# EAGLE design temperature (EAGLE 9.6.2)
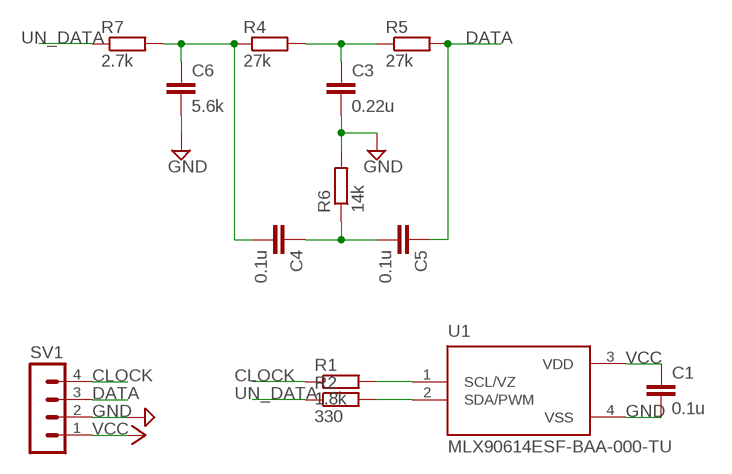
[diagram p0: schematic, sheet 1]

## Parts
C1  0.1u  C-EUC0603  [C0603]
C3  0.22u  C-EUC0603  [C0603]
C4  0.1u  C-EUC0603  [C0603]
C5  0.1u  C-EUC0603  [C0603]
C6  5.6k  C-EUC0603  [C0603]
R1  1.8k  R-EU_R0603  [R0603]
R2  330  R-EU_R0603  [R0603]
R4  27k  R-EU_R0603  [R0603]
R5  27k  R-EU_R0603  [R0603]
R6  14k  R-EU_R0603  [R0603]
R7  2.7k  R-EU_R0603  [R0603]
SV1  MA04-1  [MA04-1]
U1  MLX90614ESF-BAA-000-TU  [TO254P942H425-4]

## Nets
CLOCK: R1.1 SV1.4
DATA: C5.1 R5.2 SV1.3
GND: C1.2 C3.2 C6.2 R6.2 SV1.2 U1.4(VSS)
N$1: R1.2 U1.1(SCL/VZ)
N$2: R2.2 U1.2(SDA/PWM)
N$3: C3.1 R4.2 R5.1
N$4: C4.1 C5.2 R6.1
N$6: C4.2 C6.1 R4.1 R7.2
UN_DATA: R2.1 R7.1
VCC: C1.1 SV1.1 U1.3(VDD)

## Library data of the parts
C1 C3-C6 = rcl:C-EU: CAPACITOR, European symbol; SPICEPREFIX: C
R1 R2 R4-R7 = rcl:R-EU_: RESISTOR, European symbol; SPICEPREFIX: R
SV1 = con-lstb:MA04-1: PIN HEADER; OC_FARNELL: unknown; OC_NEWARK: unknown
U1 = MLX90614ESF-BAA-000-TU:MLX90614ESF-BAA-000-TU: Temperature Sensor Digital, Infrared (IR) -40°C ~ 85°C 16 b TO-39 Check prices <https://pricing.snapeda.com/parts/MLX90614ESF-BAA-000-TU/Melexis/view-part?ref=eda>; AVAILABILITY: In Stock; DESCRIPTION: Temperature Sensor Digital, Infrared (IR) -40°C ~ 85°C 16 b TO-39; MF: Melexis; MP: MLX90614ESF-BAA-000-TU; PACKAGE: TO-39 Melexis; PRICE: None; PURCHASE-URL: https://pricing.snapeda.com/search/part/MLX90614ESF-BAA-000-TU/?ref=eda

## Board
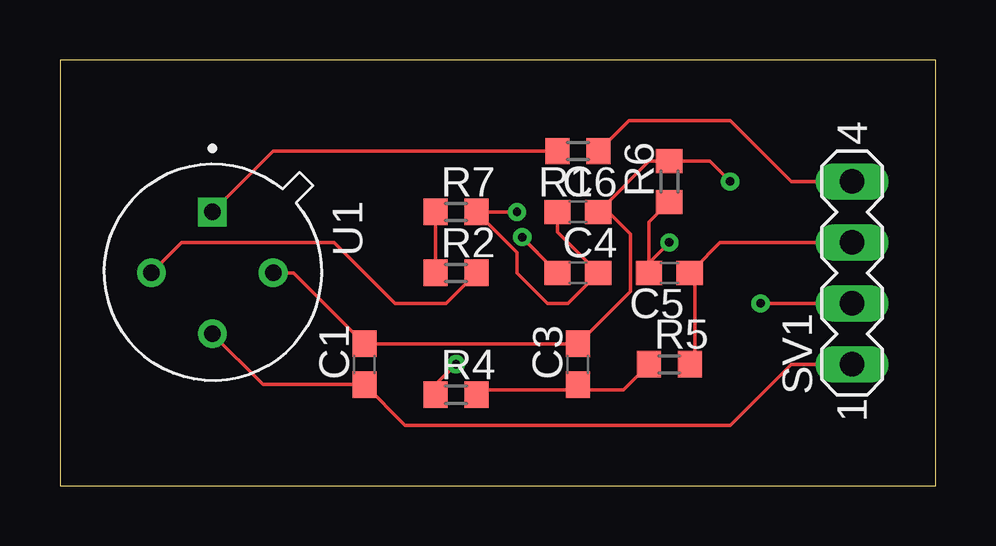
[diagram p1: board, top side]
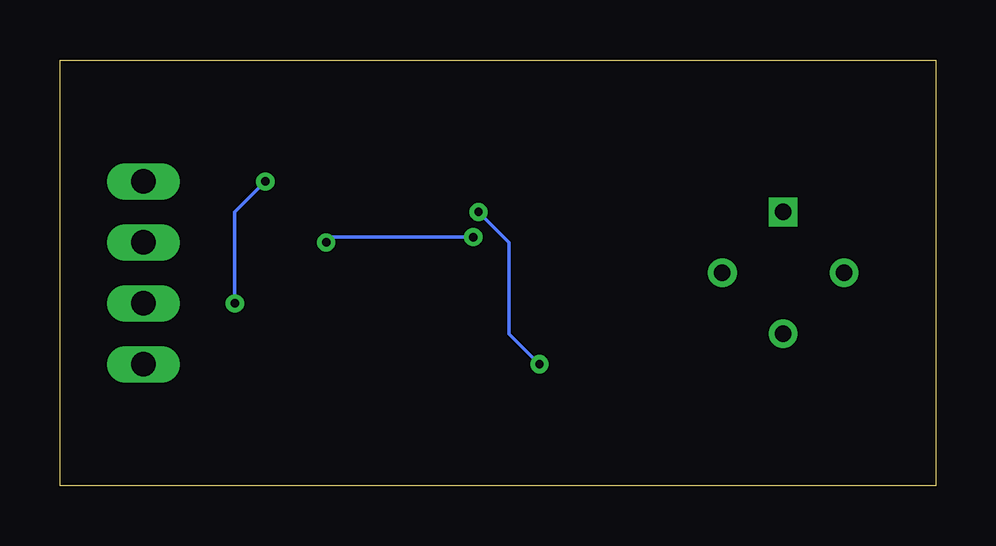
[diagram p2: board, bottom side, seen from below]

Size 36.5 x 17.77 mm. Coordinates in mm from the lower left corner, seen from the top.
Outline: 0,0 36.5,0 36.5,17.77 0,17.77 0,0
Copper layers (1*16): Top 0.035mm / dielectric 1.5mm / Bottom 0.035mm
Design rules "default": minimum track width 6mil, minimum drill 0.35mm, track to track 6mil, track to pad 6mil, pad to pad 6mil, via to via 6mil, smd to smd 6mil, copper to edge 40mil, drill to drill 6mil, minimum pad ring 10mil, minimum via ring 8mil, stop-mask expansion 4mil, vias tented up to drill 0mil, thermal gap 10mil

### Footprints (pad centres in the part's own frame; a part is rotated, then mirrored left to right if it is on the bottom)
C0603 = smd 1.1 x 1: 1 -0.85,0; 2 0.85,0
R0603 = smd 1 x 1.1: 1 -0.85,0; 2 0.85,0
MA04-1 = drill 1.016 long: 1 -3.81,0; 2 -1.27,0; 3 1.27,0; 4 3.81,0
TO254P942H425-4 = drill 0.69 pad 1.09 square: 1 -2.54,0 | drill 0.69 pad 1.09: 2 0,-2.54; 3 2.54,0; 4 0,2.54

### Placement (x,y rotation side)
C1  12.7,5.08 90 top
C3  21.59,5.08 90 top
C4  21.59,8.89 0 top
C5  25.4,8.89 180 top
C6  21.59,11.43 0 top
R1  21.59,13.97 180 top
R2  16.51,8.89 0 top
R4  16.51,3.81 0 top
R5  25.4,5.08 0 top
R6  25.4,12.7 90 top
R7  16.51,11.43 0 top
SV1  33.02,8.89 90 top
U1  6.35,8.89 270 top

### Tracks (layer width: path | path; a pad name or v marks a point on that pad's centre or on a via)
CLOCK
  Top 0.152: R1.1 23.71,15.24 27.94,15.24 30.48,12.7 SV1.4
DATA
  Top 0.152: C5.1 26.46,9.1 | 26.46,9.1 27.52,10.16 SV1.3 | R5.2 26.46,5.29 26.46,9.1
GND  (via drill 0.35)
  Top 0.152: U1.4 9.74,8.89 C1.2 C3.2 23.77,8.11 23.77,10.52 22.65,11.64 | 22.65,11.64 24.56,13.55 R6.2 27.09,13.55 v27.94,12.7 | 22.65,11.64 C6.2 | v29.21,7.62 SV1.2
  Bottom 0.152: v27.94,12.7 29.21,11.43 v29.21,7.62
N$1
  Top 0.152: U1.1 8.89,13.97 R1.2
N$2
  Top 0.152: U1.2 5.08,10.16 11.43,10.16 13.97,7.62 16.09,7.62 R2.2
N$3
  Top 0.152: C3.1 21.8,4.02 | 21.8,4.02 22.01,3.81 | R4.2 17.57,4.02 21.8,4.02 | R5.1 23.49,4.02 21.8,4.02
N$4  (via drill 0.35)
  Top 0.152: R6.1 24.55,11 C5.2 24.55,9.31 v25.4,10.16 | C4.1 19.9,9.73 | 19.9,9.73 19.47,10.16 | v19.27,10.38 19.9,9.75 19.9,9.73
  Bottom 0.152: v19.27,10.38 25.18,10.38 v25.4,10.16
N$6  (via drill 0.35)
  Top 0.152: C6.1 20.74,10.59 C4.2 21.38,7.83 21.17,7.62 20.32,7.62 19.05,8.89 19.05,9.74 R7.2 v19.05,11.43 | R4.1 15.66,4.23 v16.51,5.08
  Bottom 0.152: v16.51,5.08 17.78,6.35 17.78,10.16 v19.05,11.43
UN_DATA
  Top 0.152: R7.1 R2.1
VCC
  Top 0.152: U1.3 8.47,4.23 C1.1 14.39,2.54 27.94,2.54 30.48,5.08 SV1.1